# Altium schematic sheet 1_AT_Link_EZ_V1.2.SchDoc
size A4
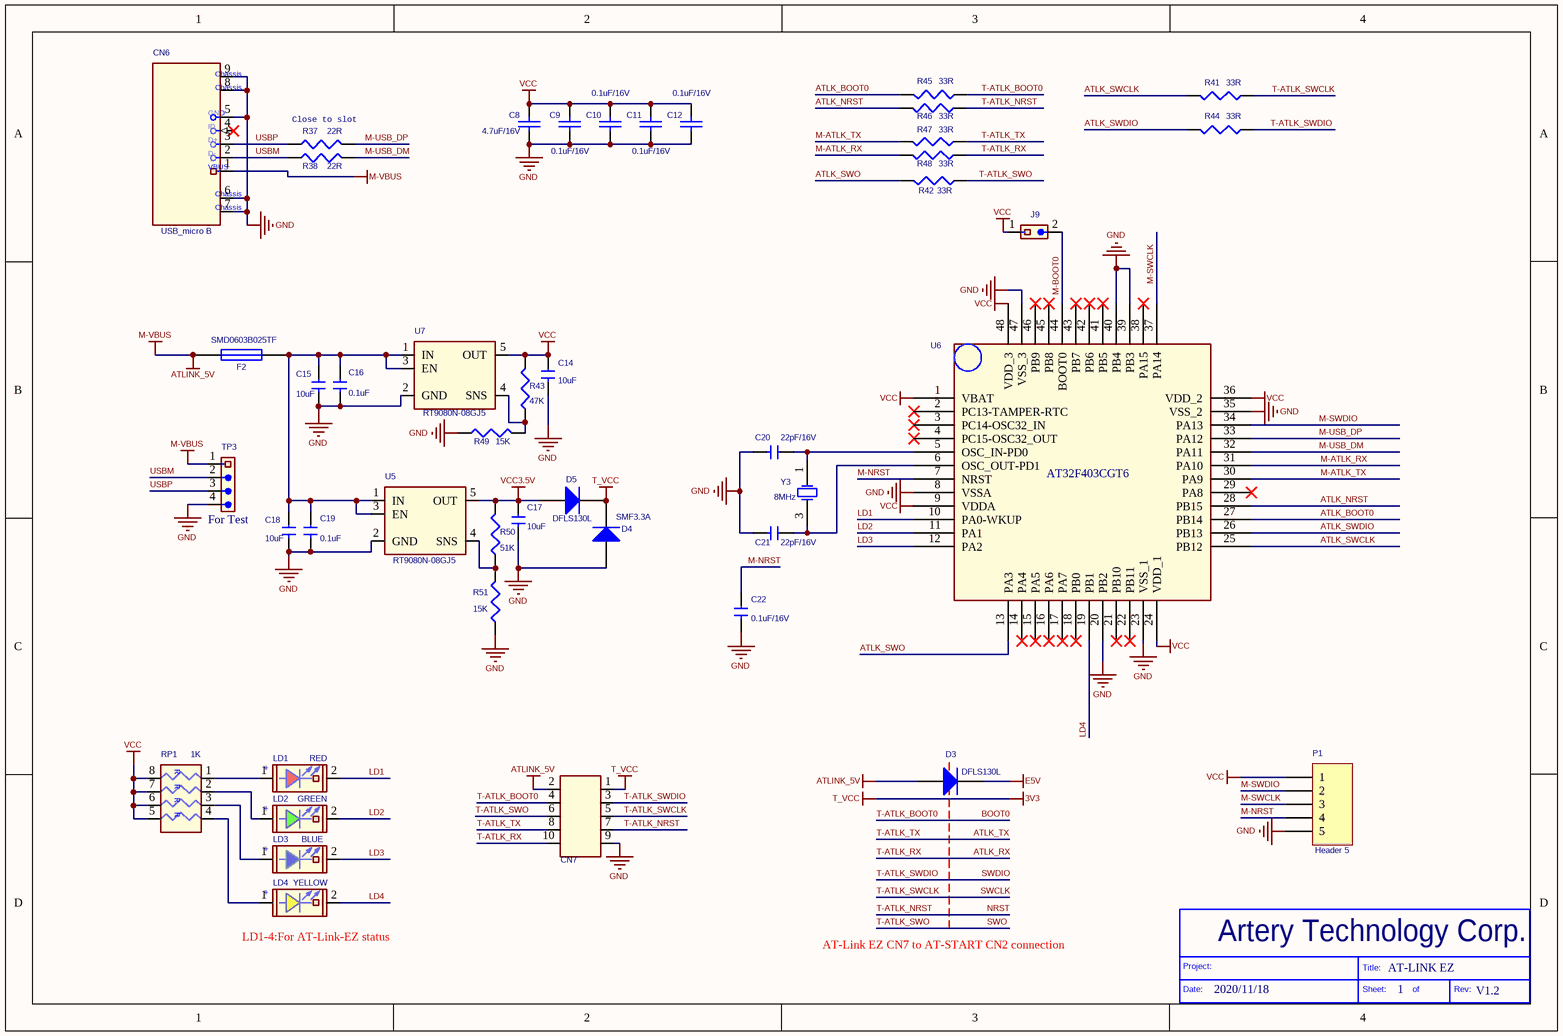
[diagram p0: 1_AT_Link_EZ_V1.2.SchDoc]

## Parts
C8  4.7uF/16V  [C0603]
C9  0.1uF/16V  [C0603]
C10  0.1uF/16V  [C0603]
C11  0.1uF/16V  [C0603]
C12  0.1uF/16V  [C0603]
C14  10uF  [C0603]
C15  10uF  [C0603]
C16  0.1uF  [C0603]
C17  10uF  [C0603]
C18  10uF  [C0603]
C19  0.1uF  [C0603]
C20  22pF/16V  [C0603]
C21  22pF/16V  [C0603]
C22  0.1uF/16V  [C0603]
CN6  USB_micro B  [USB_MIC_DIP]
CN7  CON1  [HDR2X5]  (value not drawn)
D3  DFLS130L  [SOD-123]
D4  SMF3.3A  [SOD-123]
D5  DFLS130L  [SOD-123]
F2  SMD0603B025TF  [r0603]
J9  1X2P_2.54M  [HDR1X2]  (value not drawn)
LD1  RED  [LED0603]
LD2  GREEN  [LED0603]
LD3  BLUE  [LED0603]
LD4  YELLOW  [LED0603]
P1  Header 5  [HDR1X5]
R37  22R  [R0603]
R38  22R  [R0603]
R41  33R  [R0603]
R42  33R  [R0603]
R43  47K  [R0603]
R44  33R  [R0603]
R45  33R  [R0603]
R46  33R  [R0603]
R47  33R  [R0603]
R48  33R  [R0603]
R49  15K  [R0603]
R50  51K  [R0603]
R51  15K  [R0603]
RP1  1K  [RP_4-0603]
TP3  1X4P_2.54F  [HDR1X4 - top]  (value not drawn)
U5  RT9080N-08GJ5  [SOT-23-5]
U6  AT32F403CGT6  [LQFP48 - 2]
U7  RT9080N-08GJ5  [SOT-23-5]
Y3  8MHz  [SMD_5032_4P]

## Nets
3V3: CN7.1 D4.2(K) D5.2(K)  [also labelled T_VCC]
ATLINK_5V: CN6.1(VBUS) CN7.2 D3.1(A) F2.1 TP3.1  [also labelled M-VBUS]
E5V: D3.2(K)
GND: C8.1 C9.1 C10.1 C11.1 C12.1 C14.2 C15.2 C16.2 C17.2 C18.2 C19.2 C20.2 C21.2 C22.2 CN6.5(GND) CN6.6 CN6.7 CN6.8 CN6.9 CN7.9 D4.1(A) P1.5 R49.1 R51.1 TP3.4 U5.2(GND) U6.8(VSSA) U6.20(PB2) U6.23(VSS_1) U6.35(VSS_2) U6.39(PB3) U6.40(PB4) U6.47(VSS_3) U7.2(GND)
VCC: C8.2 C9.2 C10.2 C11.2 C12.2 C14.1 J9.1 P1.1 R43.2 RP1.5 RP1.6 RP1.7 RP1.8 U6.1(VBAT) U6.9(VDDA) U6.24(VDD_1) U6.36(VDD_2) U6.48(VDD_3) U7.5(OUT)
VCC3.5V: C17.1 D5.1(A) R50.2 U5.5(OUT)
ATLK_BOOT0: R45.2 U6.27(PB14)
ATLK_NRST: R46.2 U6.28(PB15)
ATLK_RX: CN7.10 R48.1  [also labelled T-ATLK_RX]
ATLK_SWCLK: R41.2 U6.25(PB12)
ATLK_SWDIO: R44.2 U6.26(PB13)
ATLK_SWO: R42.2 U6.13(PA3)
ATLK_TX: CN7.8 R47.1  [also labelled T-ATLK_TX]
BOOT0: CN7.4 R45.1  [also labelled T-ATLK_BOOT0]
LD1: LD1.2(CATHODE) U6.10(PA0-WKUP)
LD2: LD2.2(CATHODE) U6.11(PA1)
LD3: LD3.2(CATHODE) U6.12(PA2)
LD4: LD4.2(CATHODE) U6.19(PB1)
M-ATLK_RX: R48.2 U6.31(PA10)
M-ATLK_TX: R47.2 U6.30(PA9)
M-BOOT0: J9.2 U6.44(BOOT0)
M-NRST: C22.1 P1.4 U6.7(NRST)
M-SWCLK: P1.3 U6.37(PA14)
M-SWDIO: P1.2 U6.34(PA13)
M-USB_DM: R38.2 U6.32(PA11)
M-USB_DP: R37.2 U6.33(PA12)
NRST: CN7.7 R46.1  [also labelled T-ATLK_NRST]
SWCLK: CN7.5 R41.1  [also labelled T-ATLK_SWCLK]
SWDIO: CN7.3 R44.1  [also labelled T-ATLK_SWDIO]
SWO: CN7.6 R42.1  [also labelled T-ATLK_SWO]
USBM: CN6.2(D-) R38.1 TP3.2
USBP: CN6.3(D+) R37.1 TP3.3
NetC15_1: C15.1 C16.1 C18.1 C19.1 F2.2 U5.1(IN) U5.3(EN) U7.1(IN) U7.3(EN)
NetC20_1: C20.1 U6.5(OSC_IN-PD0) Y3.1(OSC1)
NetC21_1: C21.1 U6.6(OSC_OUT-PD1) Y3.3(OSC2)
NetLD1_1: LD1.1(ANODE) RP1.1
NetLD2_1: LD2.1(ANODE) RP1.2
NetLD3_1: LD3.1(ANODE) RP1.3
NetLD4_1: LD4.1(ANODE) RP1.4
NetR43_1: R43.1 R49.2 U7.4(SNS)
NetR50_1: R50.1 R51.2 U5.4(SNS)

Not connected (* = marked no-connect by the designer): CN6 4(ID)*; U6 2(PC13-TAMPER-RTC)* 3(PC14-OSC32_IN)* 4(PC15-OSC32_OUT)* 14(PA4)* 15(PA5)* 16(PA6)* 17(PA7)* 18(PB0)* 21(PB10)* 22(PB11)* 29(PA8)* 38(PA15)* 41(PB5)* 42(PB6)* 43(PB7)* 45(PB8)* 46(PB9)*

## Notes on the sheet
- Close to slot
- (near TP3) For Test
- (near LD4) LD1-4:For AT-Link-EZ status
- AT-Link EZ CN7 to AT-START CN2 connection
- AT-LINK EZ
- 2020/11/18
- 1
- V1.2
- Project:
- Date:
- Artery Technology Corp.
- Title:
- Sheet:
- of
- Rev:
- (in symbol 22,1/16W,5%,8P4R) R
- (in symbol BLUE,SMD0603) +
- (in symbol GREEN,SMD0603) +
- (in symbol RED,SMD0603) +
- (in symbol USB_miniAB,SMD_0) Chassis
- (in symbol YELLOW,SMD0603) +

## Library data of the parts
C8 = Cap Semi: Capacitor (Semiconductor SIM Model); Value: 4.7uf; Published: 8-Jun-2000; LatestRevisionDate: 29-May-2009; LatestRevisionNote: IPC-7351 Footprint Added.; PackageReference: C1206; Publisher: Altium Limited; PackageDescription: Chip Capacitor
C9-C12 = Cap Semi: Capacitor (Semiconductor SIM Model); Value: 0.1uf; Published: 8-Jun-2000; LatestRevisionDate: 29-May-2009; LatestRevisionNote: IPC-7351 Footprint Added.; PackageReference: C1206; Publisher: Altium Limited; PackageDescription: Chip Capacitor
C14-C19 C22 = 0.1uF,50V,20%,SMD0603
C20 C21 = 10pF,50V,5%,SMD0603
CN6 = USB_miniAB,SMD_0
CN7 = CON10A_0
D3-D5 = Diode: Default Diode; Published: 8-Jun-2000; LatestRevisionDate: 17-Jul-2002; LatestRevisionNote: Re-released for DXP Platform.; PackageVersion: Sep-1996; PackageReference: SMC; Publisher: Altium Limited; PackageDescription: DO-214-AB/SMC; 2 C-Bend Leads; Body 7.9 x 5.9 mm, inc. leads (LxW); Code_JEDEC: DO-214-AB
F2 = Fuse 1: Fuse; Published: 8-Jun-2000; LatestRevisionDate: 17-Jul-2002; LatestRevisionNote: Re-released for DXP Platform.; PackageReference: PIN-W2/E2.8; Publisher: Altium Limited; PackageDescription: Thru-Hole; 2 Leads
J9 = 1X2P,Male,DIP_2.54
LD1 = RED,SMD0603
LD2 = GREEN,SMD0603
LD3 = BLUE,SMD0603: 贴片LED 蓝色 0603
LD4 = YELLOW,SMD0603
P1 = Header 5: Header, 5-Pin; LatestRevisionDate: 17-Jul-2002; LatestRevisionNote: Re-released for DXP Platform.; Publisher: Altium Limited
R37 R38 R41 R44-R48 = 22,1/10W,1%,SMD0603
R42 = 22,1/10W,1%,SMD0603: 贴片电阻33R,1/10W,5%,0603
R43 R49-R51 = 470,1/10W,1%,SMD0603
RP1 = 22,1/16W,5%,8P4R
TP3 = 1X4P,Female,DIP_2.54
U5 U7 = RT9080N
U6 = LQFP48&QFN48
Y3 = SMD-5032_4P  8MHZ 20PF 10PPM: ?片晶振; ComponentLink1Description: 供?商?接; ComponentLink1URL: http://www.szlcsc.com/product/details_9522.html; Package: SMD-3225_4P; Supplier: LC; SuppliersPartNumber: C9002